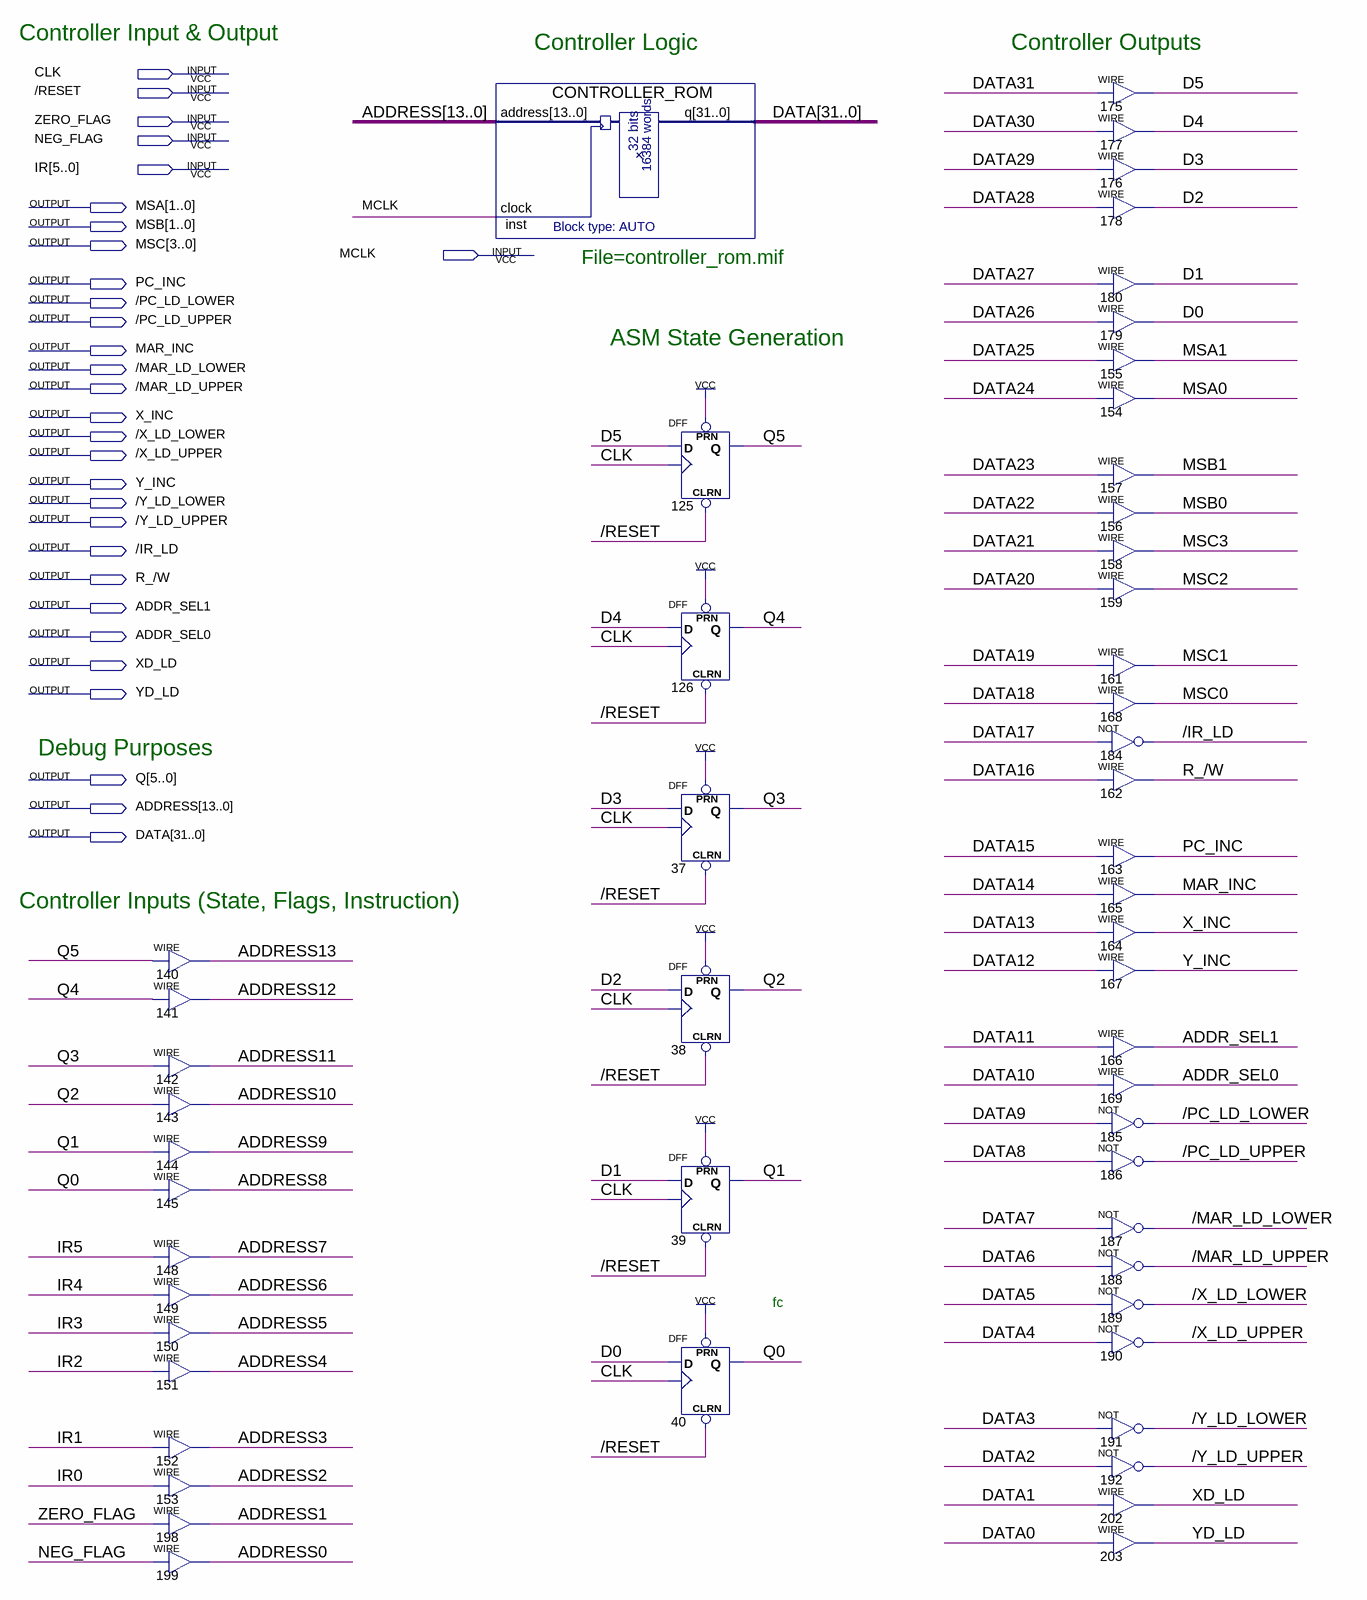
[diagram p0: schematic sheet]
// Quartus schematic controller.bdf as structural Verilog: 53 symbols, 30 pins
module controller (
  input  CLK,
  input  \/RESET ,
  input  ZERO_FLAG,
  input  NEG_FLAG,
  input  [5:0] IR,
  input  MCLK,
  output [1:0] MSA,
  output [1:0] MSB,
  output [3:0] MSC,
  output PC_INC,
  output \/PC_LD_LOWER ,
  output \/PC_LD_UPPER ,
  output MAR_INC,
  output \/MAR_LD_LOWER ,
  output \/MAR_LD_UPPER ,
  output X_INC,
  output \/X_LD_LOWER ,
  output \/X_LD_UPPER ,
  output Y_INC,
  output \/Y_LD_LOWER ,
  output \/Y_LD_UPPER ,
  output \/IR_LD ,
  output \R_/W ,
  output ADDR_SEL1,
  output ADDR_SEL0,
  output XD_LD,
  output YD_LD,
  output [5:0] Q,
  output [13:0] ADDRESS,
  output [31:0] DATA
);

  wire D0, D1, D2, D3, D4, D5;

  assign ADDRESS[13] = Q[5];  // WIRE 140
  assign ADDRESS[12] = Q[4];  // WIRE 141
  assign ADDRESS[11] = Q[3];  // WIRE 142
  assign ADDRESS[10] = Q[2];  // WIRE 143
  assign ADDRESS[9] = Q[1];  // WIRE 144
  assign ADDRESS[8] = Q[0];  // WIRE 145
  assign ADDRESS[7] = IR[5];  // WIRE 148
  assign ADDRESS[6] = IR[4];  // WIRE 149
  assign ADDRESS[5] = IR[3];  // WIRE 150
  assign ADDRESS[4] = IR[2];  // WIRE 151
  assign ADDRESS[3] = IR[1];  // WIRE 152
  assign ADDRESS[2] = IR[0];  // WIRE 153
  assign ADDRESS[1] = ZERO_FLAG;  // WIRE 198
  assign ADDRESS[0] = NEG_FLAG;  // WIRE 199
  CONTROLLER_ROM inst (.address(ADDRESS), .clock(MCLK), .q(DATA));
  DFF u_125 (.CLRN(\/RESET ), .CLK(CLK), .D(D5), .PRN(1'b1), .Q(Q[5]));
  DFF u_126 (.CLRN(\/RESET ), .CLK(CLK), .D(D4), .PRN(1'b1), .Q(Q[4]));
  DFF u_37 (.CLRN(\/RESET ), .CLK(CLK), .D(D3), .PRN(1'b1), .Q(Q[3]));
  DFF u_38 (.CLRN(\/RESET ), .CLK(CLK), .D(D2), .PRN(1'b1), .Q(Q[2]));
  DFF u_39 (.CLRN(\/RESET ), .CLK(CLK), .D(D1), .PRN(1'b1), .Q(Q[1]));
  DFF u_40 (.CLRN(\/RESET ), .CLK(CLK), .D(D0), .PRN(1'b1), .Q(Q[0]));
  assign D5 = DATA[31];  // WIRE 175
  assign D4 = DATA[30];  // WIRE 177
  assign D3 = DATA[29];  // WIRE 176
  assign D2 = DATA[28];  // WIRE 178
  assign D1 = DATA[27];  // WIRE 180
  assign D0 = DATA[26];  // WIRE 179
  assign MSA[1] = DATA[25];  // WIRE 155
  assign MSA[0] = DATA[24];  // WIRE 154
  assign MSB[1] = DATA[23];  // WIRE 157
  assign MSB[0] = DATA[22];  // WIRE 156
  assign MSC[3] = DATA[21];  // WIRE 158
  assign MSC[2] = DATA[20];  // WIRE 159
  assign MSC[1] = DATA[19];  // WIRE 161
  assign MSC[0] = DATA[18];  // WIRE 168
  not u_184 (\/IR_LD , DATA[17]);
  assign \R_/W  = DATA[16];  // WIRE 162
  assign PC_INC = DATA[15];  // WIRE 163
  assign MAR_INC = DATA[14];  // WIRE 165
  assign X_INC = DATA[13];  // WIRE 164
  assign Y_INC = DATA[12];  // WIRE 167
  assign ADDR_SEL1 = DATA[11];  // WIRE 166
  assign ADDR_SEL0 = DATA[10];  // WIRE 169
  not u_185 (\/PC_LD_LOWER , DATA[9]);
  not u_186 (\/PC_LD_UPPER , DATA[8]);
  not u_187 (\/MAR_LD_LOWER , DATA[7]);
  not u_188 (\/MAR_LD_UPPER , DATA[6]);
  not u_189 (\/X_LD_LOWER , DATA[5]);
  not u_190 (\/X_LD_UPPER , DATA[4]);
  not u_191 (\/Y_LD_LOWER , DATA[3]);
  not u_192 (\/Y_LD_UPPER , DATA[2]);
  assign XD_LD = DATA[1];  // WIRE 202
  assign YD_LD = DATA[0];  // WIRE 203

  // Notes on the sheet:
  //   Controller Input & Output
  //   Controller Logic 
  //   Controller Outputs
  //   File=controller_rom.mif
  //   ASM State Generation
  //   Debug Purposes
  //   Controller Inputs (State, Flags, Instruction)
  //   fc
endmodule
